# EAGLE design siren (EAGLE 7.5.0)
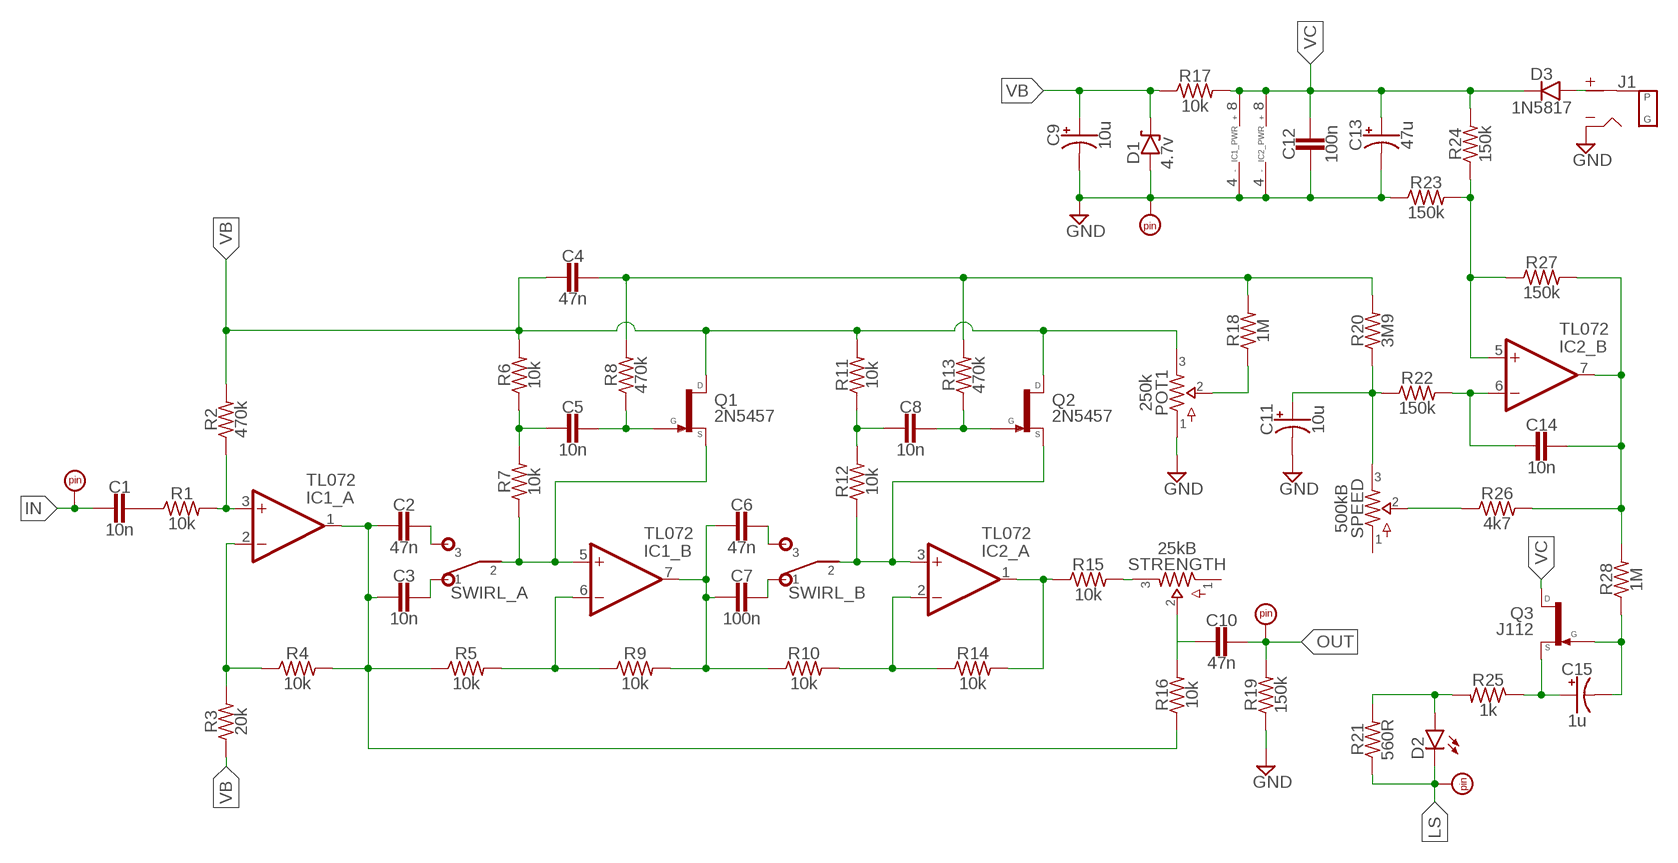
[diagram p0: schematic, sheet 1]

## Parts
C1  10n  CER/FILM2  [050X030_025_2]
C2  47n  CER/FILM2  [050X030_025_2]
C3  10n  CER/FILM2  [050X030_025_2]
C4  47n  CER/FILM2  [050X030_025_2]
C5  10n  CER/FILM2  [050X030_025_2]
C6  47n  CER/FILM2  [050X030_025_2]
C7  100n  CER/FILM2  [050X030_025_2]
C8  10n  CER/FILM2  [050X030_025_2]
C9  10u  0501  [050_020_1]
C10  47n  CER/FILM2  [050X030_025_2]
C11  10u  0501  [050_020_1]
C12  100n  CER/FILM2  [050X030_025_2]
C13  47u  0501  [050_020_1]
C14  10n  CER/FILM2  [050X030_025_2]
C15  1u  0501  [050_020_1]
D1  4.7v  ZENER.2  [DO41-2]
D2  LEDB  [3MM_B]
D3  1N5817  DO41.3  [DO41-3]
IC1  TL072  DUALTH  [DIL08]
IC2  TL072  DUALTH  [DIL08]
J1  DC_MONO  [DC]
PAD1  PADSQR  [SQUARE]
PAD2  PADRND  [ROUND]
PAD3  PADSQR  [SQUARE]
PAD4  PADSQR  [SQUARE]
POT1  250k  POTSTRIM  [2262_TRIM]
Q1  2N5457  [TO92-]
Q2  2N5457  [TO92-]
Q3  J112  2N5457  [TO92-]
R1  10k  R_.3B  [R0207/3]
R2  470k  R_.3B  [R0207/3]
R3  20k  R_.3B  [R0207/3]
R4  10k  R_.3B  [R0207/3]
R5  10k  R_.3B  [R0207/3]
R6  10k  R_.3B  [R0207/3]
R7  10k  R_.3B  [R0207/3]
R8  470k  R_.3B  [R0207/3]
R9  10k  R_.3B  [R0207/3]
R10  10k  R_.3B  [R0207/3]
R11  10k  R_.3B  [R0207/3]
R12  10k  R_.3B  [R0207/3]
R13  470k  R_.3B  [R0207/3]
R14  10k  R_.3B  [R0207/3]
R15  10k  R_.3B  [R0207/3]
R16  10k  R_.3B  [R0207/3]
R17  10k  R_.3B  [R0207/3]
R18  1M  R_.3B  [R0207/3]
R19  150k  R_.3B  [R0207/3]
R20  3M9  R_.3B  [R0207/3]
R21  560R  R_.3B  [R0207/3]
R22  150k  R_.3B  [R0207/3]
R23  150k  R_.3B  [R0207/3]
R24  150k  R_.3B  [R0207/3]
R25  1k  R_.3B  [R0207/3]
R26  4k7  R_.3B  [R0207/3]
R27  150k  R_.3B  [R0207/3]
R28  1M  R_.3B  [R0207/3]
SPEED  500kB  POTS16MM  [16MM]
STRENGTH  25kB  POTS16MM  [16MM]
SWIRL  DPDTPADS  [DPDT_PADS]

## Nets
GND: C9.- C11.- C12.2 C13.- D1.A IC1.4(_PWR:V-) IC2.4(_PWR:V-) J1.S(SLEEVE) PAD2.1 POT1.1 R19.1 R23.1
IN: C1.2 PAD1.1
LS: D2.K(C) PAD4.1 R21.1
N$1: C1.1 R1.1
N$2: IC1.3(_A:+IN) R1.2 R2.1
N$3: C2.2 C3.2 IC1.1(_A:OUT) R4.2 R5.1 R16.1
N$4: IC1.5(_B:+IN) Q1.2(S) R7.1 SWIRL.P$2
N$5: IC2.1(_A:OUT) R14.2 R15.1
N$6: C10.2 R16.2 STRENGTH.2
N$7: IC1.2(_A:-IN) R3.2 R4.1
N$8: POT1.2 R18.1
N$9: R26.1 SPEED.2
N$10: C5.2 R6.1 R7.2
N$11: C5.1 Q1.1(G) R8.1
N$12: C11.+ R20.1 R22.1 SPEED.3
N$13: C4.1 R8.2 R13.2 R18.2 R20.2
N$14: C14.2 IC2.6(_B:-IN) R22.2
N$15: IC1.6(_B:-IN) R5.2 R9.1
N$16: C14.1 IC2.7(_B:OUT) R26.2 R27.2 R28.2
N$17: IC2.2(_A:-IN) R10.2 R14.1
N$18: C6.2 C7.2 R9.2 R10.1
N$19: C15.- Q3.1(G) R28.1
N$20: C8.2 R11.1 R12.2
N$21: C8.1 Q2.1(G) R13.1
N$22: IC2.5(_B:+IN) R23.2 R24.1 R27.1
N$23: D3.A J1.T(TIP)
N$24: R15.2 STRENGTH.3
N$25: C2.1 SWIRL.P$3
N$26: C3.1 SWIRL.P$1
N$27: C15.+ Q3.2(S) R25.1
N$28: IC2.3(_A:+IN) Q2.2(S) R12.1 SWIRL.P$5
N$29: C6.1 SWIRL.P$6
N$30: C7.1 SWIRL.P$4
N$31: IC1.7(_B:OUT)
N$33: D2.A R21.2 R25.2
OUT: C10.1 PAD3.1 R19.2
VB: C4.2 C9.+ D1.C POT1.3 Q1.3(D) Q2.3(D) R2.2 R3.1 R6.2 R11.2 R17.1
VC: C12.1 C13.+ D3.C IC1.8(_PWR:V+) IC2.8(_PWR:V+) Q3.3(D) R17.2 R24.2
Unconnected: SPEED.1 STRENGTH.1

## Library data of the parts
C1-C8 C10 C12 C14 = capacitors-film:CER/FILM: 47 - 120pF Xicon Ceramic Disc 2.5mm lead spacing
C9 C11 C13 C15 = capacitors-elec:050: 0.22 - 100uF Xicon values at Mouser.com: 10V: 10 - 100uF; 16V: 2.2 - 47uF; 25V: 0.47 - 47uF; 50V: 0.22 - 22uF
D1 = diodes:ZENER
D2 = diodes:LED
D3 = diodes:DO41: DO-41 Package Diodes: 1N4001 - 1N40019 Zener Diodes: 1N4728 - 1N4764
IC1 IC2 = integrated circuits:DUAL: OP AMP
J1 = jacks:DC_MONO
PAD1-PAD4 = supply pins:PAD
POT1 SPEED STRENGTH = potentiometers:POTS
Q1-Q3 = transistors:2N5457: N-CHANNEL JFET
R1-R28 = resistors:R_
SWIRL = switches:DPDT

## Board
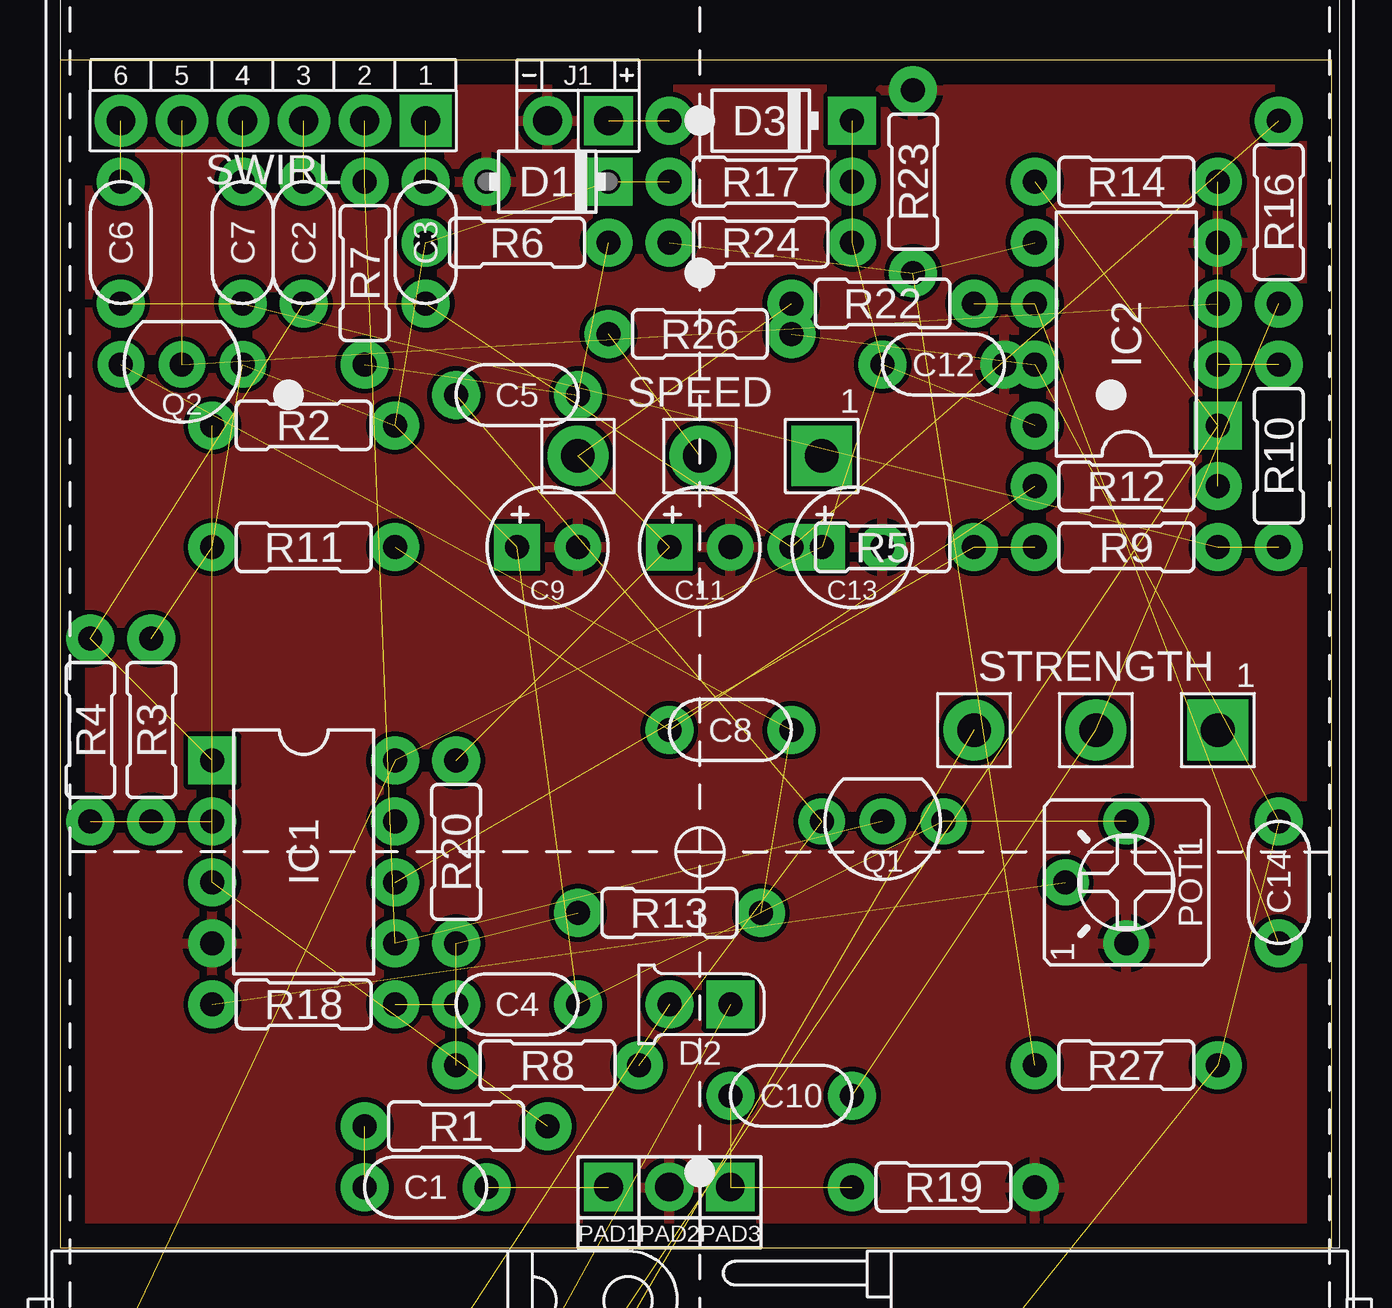
[diagram p1: board, top side]
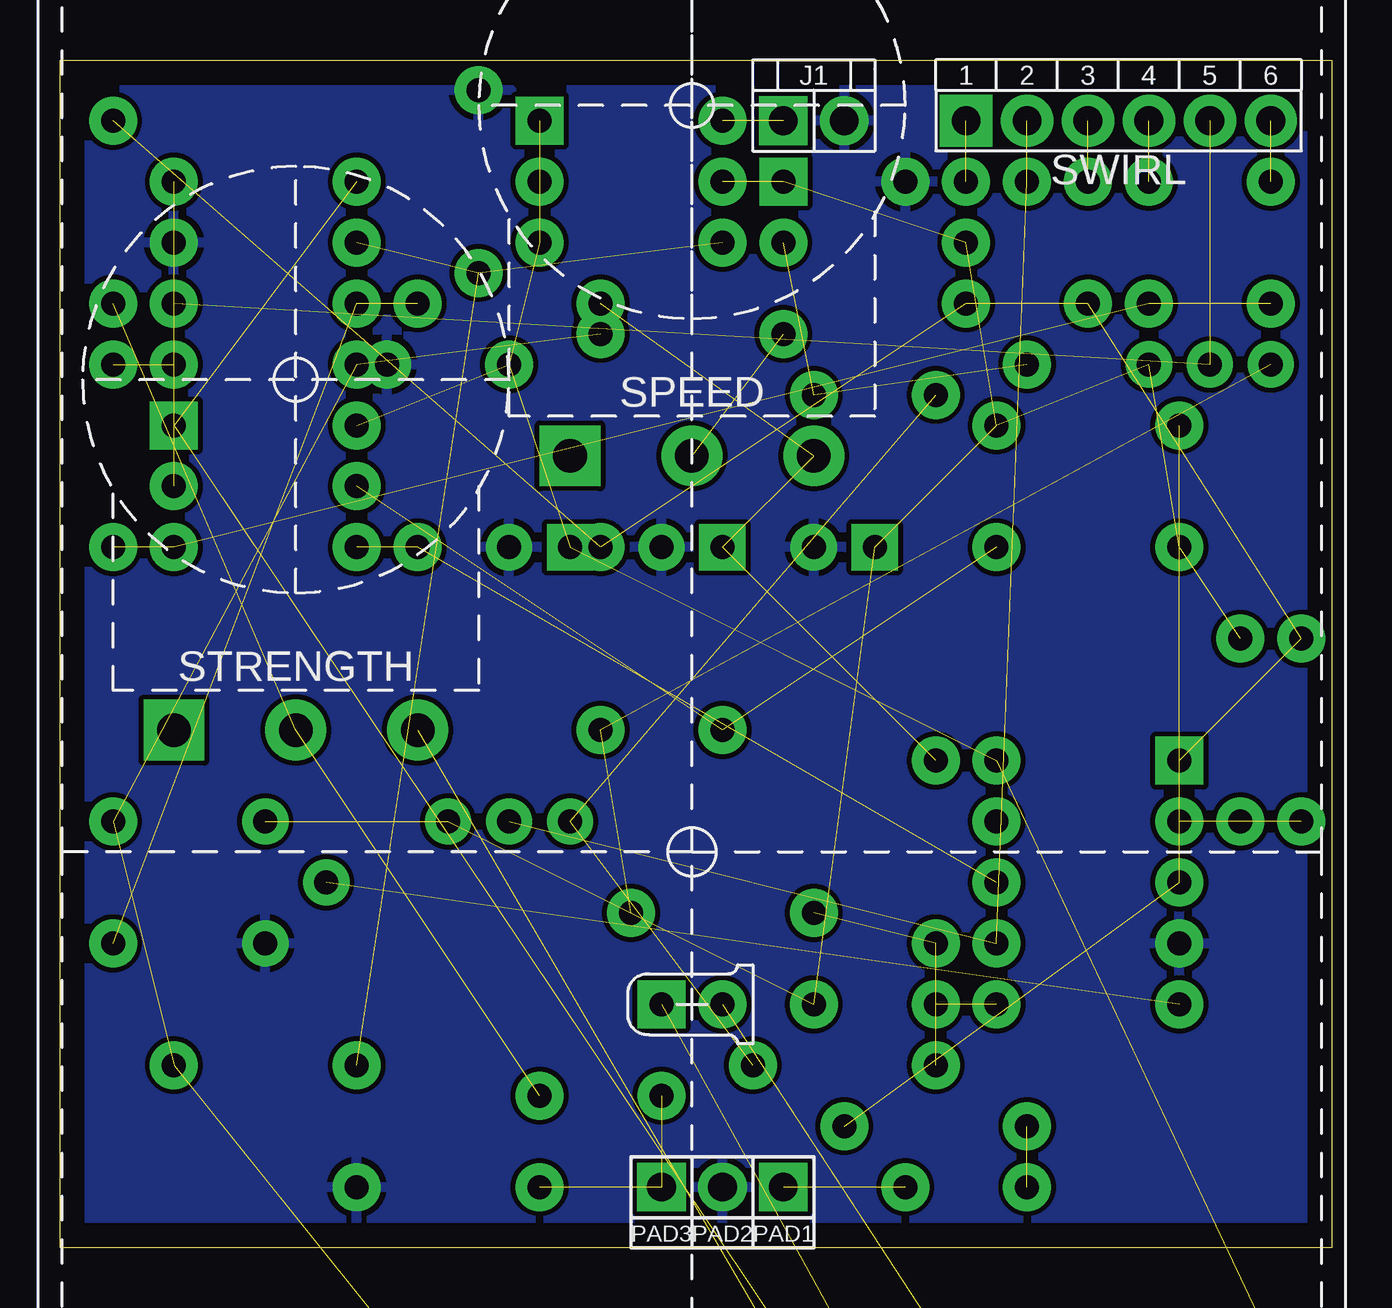
[diagram p2: board, bottom side, seen from below]

Size 53.01 x 49.52 mm. Coordinates in mm from the lower left corner, seen from the top.
Outline: 0,0 53.01,0 53.01,49.52 0,49.52 0,0
Copper layers (1*16): Top 0.035mm / dielectric 1.5mm / Bottom 0.035mm
Design rules "default": minimum track width 10mil, minimum drill 24mil, track to track 8mil, track to pad 8mil, pad to pad 8mil, via to via 8mil, smd to smd 8mil, copper to edge 40mil, drill to drill 8mil, minimum pad ring 10mil, minimum via ring 8mil, stop-mask expansion 4mil, vias tented up to drill 0mil, thermal gap 10mil

### Footprints (pad centres in the part's own frame; a part is rotated, then mirrored left to right if it is on the bottom)
050X030_025_2 = drill 1 pad 2: 1 -2.54,0; 2 2.54,0
050_020_1 = drill 1 pad 1.93 square: + -1.27,0 | drill 1 pad 1.93: - 1.27,0
DO41-2 = drill 1 pad 2: A 2.54,0 | drill 1 pad 2 square: C -2.54,0
3MM_B = drill 1 pad 2 square: A -1.27,0 | drill 1 pad 2: K 1.27,0
DO41-3 = drill 1 pad 2: A 3.81,0 | drill 1 pad 2 square: C -3.81,0
DIL08 = drill 1 pad 2 square: 1 -3.81,-3.81 | drill 1 pad 2: 2 -1.27,-3.81; 3 1.27,-3.81; 4 3.81,-3.81; 5 3.81,3.81; 6 1.27,3.81; 7 -1.27,3.81; 8 -3.81,3.81
DC = drill 1.2 pad 2.032: S -1.27,0 | drill 1.2 pad 2.032 square: T 1.27,0
SQUARE = drill 1.2 pad 2.032 square: 1 0,0
ROUND = drill 1.2 pad 2.032: 1 0,0
2262_TRIM = drill 1 pad 1.93: 1 -2.54,0; 2 0,2.54; 3 2.54,0
TO92- = drill 1 pad 1.93: 1 2.54,0; 2 0,0; 3 -2.54,0
R0207/3 = drill 1 pad 2: 1 -3.81,0; 2 3.81,0
16MM = drill 1.4 pad 2.54 square: 1 5.08,0 | drill 1.4 pad 2.54: 2 0,0; 3 -5.08,0
DPDT_PADS = drill 1.2 pad 2.184 square: P$1 -6.35,0 | drill 1.2 pad 2.184: P$2 -3.81,0; P$3 -1.27,0; P$4 1.27,0; P$5 3.81,0; P$6 6.35,0

### Placement (x,y rotation side)
C1  15.24,2.54 0 top
C2  10.16,41.91 270 top
C3  15.24,41.91 270 top
C4  19.05,10.16 0 top
C5  19.05,35.56 0 top
C6  2.54,41.91 270 top
C7  7.62,41.91 270 top
C8  27.94,21.59 180 top
C9  20.32,29.21 0 top
C10  30.48,6.35 0 top
C11  26.67,29.21 0 top
C12  36.83,36.83 0 top
C13  33.02,29.21 0 top
C14  50.8,15.24 270 top
C15  -26.67,-73.66 0 top  (outside the outline)
D1  20.32,44.45 180 top
D2  26.67,10.16 180 top
D3  29.21,46.99 180 top
IC1  10.16,16.51 270 top
IC2  44.45,38.1 90 top
J1  21.59,46.99 0 top
PAD1  22.86,2.54 0 top
PAD2  25.4,2.54 0 top
PAD3  27.94,2.54 0 top
PAD4  -31.75,-77.47 0 top  (outside the outline)
POT1  44.45,15.24 90 top
Q1  34.29,17.78 180 top
Q2  5.08,36.83 180 top
Q3  -25.4,-68.58 0 top  (outside the outline)
R1  16.51,5.08 0 top
R2  10.16,34.29 0 top
R3  3.81,21.59 270 top
R4  1.27,21.59 90 top
R5  34.29,29.21 0 top
R6  19.05,41.91 180 top
R7  12.7,40.64 270 top
R8  20.32,7.62 180 top
R9  44.45,29.21 0 top
R10  50.8,33.02 90 top
R11  10.16,29.21 180 top
R12  44.45,31.75 180 top
R13  25.4,13.97 180 top
R14  44.45,44.45 180 top
R15  -27.94,-85.09 0 top  (outside the outline)
R16  50.8,43.18 270 top
R17  29.21,44.45 0 top
R18  10.16,10.16 0 top
R19  36.83,2.54 180 top
R20  16.51,16.51 270 top
R21  -24.13,-80.01 0 top  (outside the outline)
R22  34.29,39.37 0 top
R23  35.56,44.45 270 top
R24  29.21,41.91 0 top
R25  -24.13,-77.47 0 top  (outside the outline)
R26  26.67,38.1 0 top
R27  44.45,7.62 0 top
R28  -27.94,-82.55 0 top  (outside the outline)
SPEED  26.67,33.02 0 top
STRENGTH  43.18,21.59 0 top
SWIRL  8.89,46.99 180 top
U$1  [1590B_GUIDE]  26.67,0 0 top
U$2  [1590B]  26.67,16.51 0 top
U$3  [DC_TOP]  26.67,73.66 0 top  (outside the outline)
U$4  [LED]  10.16,58.42 0 top  (outside the outline)
U$5  [LED]  43.18,58.42 0 top  (outside the outline)
U$6  [MONO_ENCLOSED]  -1.27,-7.62 90 top  (outside the outline)
U$7  [MONO_ENCLOSED]  54.61,-7.62 270 top  (outside the outline)
U$8  [3PDT]  26.67,-25.4 0 top  (outside the outline)

### Tracks (layer width: path | path; a pad name or v marks a point on that pad's centre or on a via)
GND
  pour Top: 0,49.53 53.34,49.53 53.34,0 0,0
  pour Bottom: 0,49.53 53.34,49.53 53.34,0 0,0
IN  (1 unrouted)
LS  (2 unrouted)
N$1  (1 unrouted)
N$2  (2 unrouted)
N$3  (5 unrouted)
N$4  (3 unrouted)
N$5  (2 unrouted)
N$6  (2 unrouted)
N$7  (2 unrouted)
N$8  (1 unrouted)
N$9  (1 unrouted)
N$10  (2 unrouted)
N$11  (2 unrouted)
N$12  (3 unrouted)
N$13  (4 unrouted)
N$14  (2 unrouted)
N$15  (2 unrouted)
N$16  (4 unrouted)
N$17  (2 unrouted)
N$18  (3 unrouted)
N$19  (2 unrouted)
N$20  (2 unrouted)
N$21  (2 unrouted)
N$22  (3 unrouted)
N$23  (1 unrouted)
N$24  (1 unrouted)
N$25  (1 unrouted)
N$26  (1 unrouted)
N$27  (2 unrouted)
N$28  (3 unrouted)
N$29  (1 unrouted)
N$30  (1 unrouted)
N$33  (2 unrouted)
OUT  (2 unrouted)
VB  (10 unrouted)
VC  (7 unrouted)